# Altium schematic sheet [06]-CPU-CAN,QUAD_ENCODER.SchDoc: S32K1_CONTROLLER
size A3; SheetNumber: 06; SheetTotal: 11
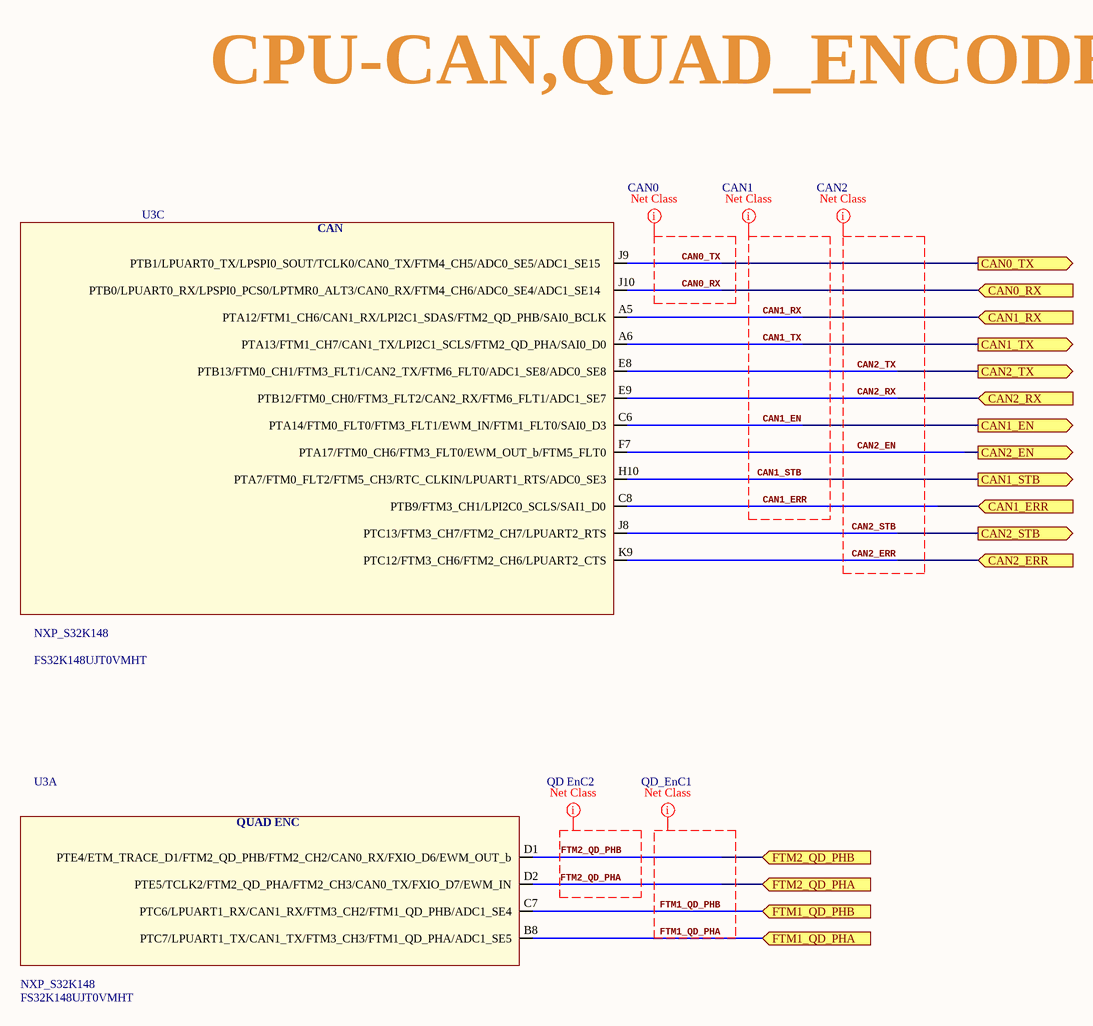
[diagram p0: [06]-CPU-CAN,QUAD_ENCODER.SchDoc]

## Parts
U3  NXP_S32K148  Manufacturer Part Number: FS32K148UJT0VMHT  [WEONREFERENCEPLATFORM_100MAPBGA]  (parts A,C of 8)

## Ports
CAN0_RX (in), CAN0_TX (out), CAN1_EN (out), CAN1_ERR (in), CAN1_RX (in), CAN1_STB (out), CAN1_TX (out), CAN2_EN (out), CAN2_ERR (in), CAN2_RX (in), CAN2_STB (out), CAN2_TX (out), FTM1_QD_PHA (in), FTM1_QD_PHB (in), FTM2_QD_PHA (in), FTM2_QD_PHB (in)

## Nets
CAN0_RX: U3.J10(PTB0/LPUART0_RX/LPSPI0_PCS0/LPTMR0_ALT3/CAN0_RX/FTM4_CH6/ADC0_SE4/ADC1_SE14) ; port CAN0_RX
CAN0_TX: U3.J9(PTB1/LPUART0_TX/LPSPI0_SOUT/TCLK0/CAN0_TX/FTM4_CH5/ADC0_SE5/ADC1_SE15) ; port CAN0_TX
CAN1_EN: U3.C6(PTA14/FTM0_FLT0/FTM3_FLT1/EWM_IN/FTM1_FLT0/SAI0_D3) ; port CAN1_EN
CAN1_ERR: U3.C8(PTB9/FTM3_CH1/LPI2C0_SCLS/SAI1_D0) ; port CAN1_ERR
CAN1_RX: U3.A5(PTA12/FTM1_CH6/CAN1_RX/LPI2C1_SDAS/FTM2_QD_PHB/SAI0_BCLK) ; port CAN1_RX
CAN1_STB: U3.H10(PTA7/FTM0_FLT2/FTM5_CH3/RTC_CLKIN/LPUART1_RTS/ADC0_SE3) ; port CAN1_STB
CAN1_TX: U3.A6(PTA13/FTM1_CH7/CAN1_TX/LPI2C1_SCLS/FTM2_QD_PHA/SAI0_D0) ; port CAN1_TX
CAN2_EN: U3.F7(PTA17/FTM0_CH6/FTM3_FLT0/EWM_OUT_b/FTM5_FLT0) ; port CAN2_EN
CAN2_ERR: U3.K9(PTC12/FTM3_CH6/FTM2_CH6/LPUART2_CTS) ; port CAN2_ERR
CAN2_RX: U3.E9(PTB12/FTM0_CH0/FTM3_FLT2/CAN2_RX/FTM6_FLT1/ADC1_SE7) ; port CAN2_RX
CAN2_STB: U3.J8(PTC13/FTM3_CH7/FTM2_CH7/LPUART2_RTS) ; port CAN2_STB
CAN2_TX: U3.E8(PTB13/FTM0_CH1/FTM3_FLT1/CAN2_TX/FTM6_FLT0/ADC1_SE8/ADC0_SE8) ; port CAN2_TX
FTM1_QD_PHA: U3.B8(PTC7/LPUART1_TX/CAN1_TX/FTM3_CH3/FTM1_QD_PHA/ADC1_SE5) ; port FTM1_QD_PHA
FTM1_QD_PHB: U3.C7(PTC6/LPUART1_RX/CAN1_RX/FTM3_CH2/FTM1_QD_PHB/ADC1_SE4) ; port FTM1_QD_PHB
FTM2_QD_PHA: U3.D2(PTE5/TCLK2/FTM2_QD_PHA/FTM2_CH3/CAN0_TX/FXIO_D7/EWM_IN) ; port FTM2_QD_PHA
FTM2_QD_PHB: U3.D1(PTE4/ETM_TRACE_D1/FTM2_QD_PHB/FTM2_CH2/CAN0_RX/FXIO_D6/EWM_OUT_b) ; port FTM2_QD_PHB

## Layout directives
net class QD EnC2: FTM2_QD_PHA, FTM2_QD_PHB
net class QD_EnC1: FTM1_QD_PHA, FTM1_QD_PHB
net class CAN0: CAN0_RX, CAN0_TX
net class CAN1: CAN1_EN, CAN1_ERR, CAN1_RX, CAN1_STB, CAN1_TX
net class CAN2: CAN2_EN, CAN2_ERR, CAN2_RX, CAN2_STB, CAN2_TX

## Notes on the sheet
- CPU-CAN,QUAD_ENCODER
- Title
- Size:
- Date:
- A3
- Number:
- Time:
- Revision:
- Sheet
- of
- File:
- (in symbol NXP_S32K148, part A) QUAD ENC
- (in symbol NXP_S32K148, part C) CAN

## Library data of the parts
U3 = NXP_S32K148: Manufacturer: NXP Semiconductors; Supplier 1: Digikey; Stock 1: 855; Pricing 1: 1 = 16.32000, 10 = 14.99600, 25 = 14.37440, 100 = 12.66510, 880 = 11.26650 (USD); Supplier Part Number 1: 568-13929-ND